# Altium schematic sheet CPU_ETH.SchDoc: Thermostat
size 420 x 297 mm; Author: G.Kasprowicz; CompanyName: WUT ISE; DrawnBy: G.Kasprowicz; Organization: WUT ISE; Address1: PW ISE; Address2: Nowowiejska 15/19 00-665 Warsaw; Address3: gkasprow@gmail.com; DocumentNumber: 2; Revision: 1.0; SheetNumber: 2; SheetTotal: 2; ModifiedBy: -; CheckedDate: -; Title2: CPU v1.0; DivGrp: WUT ISE; Designer: G.Kasprowicz; ModifiedDate: -; ProjectName: Sensor Box
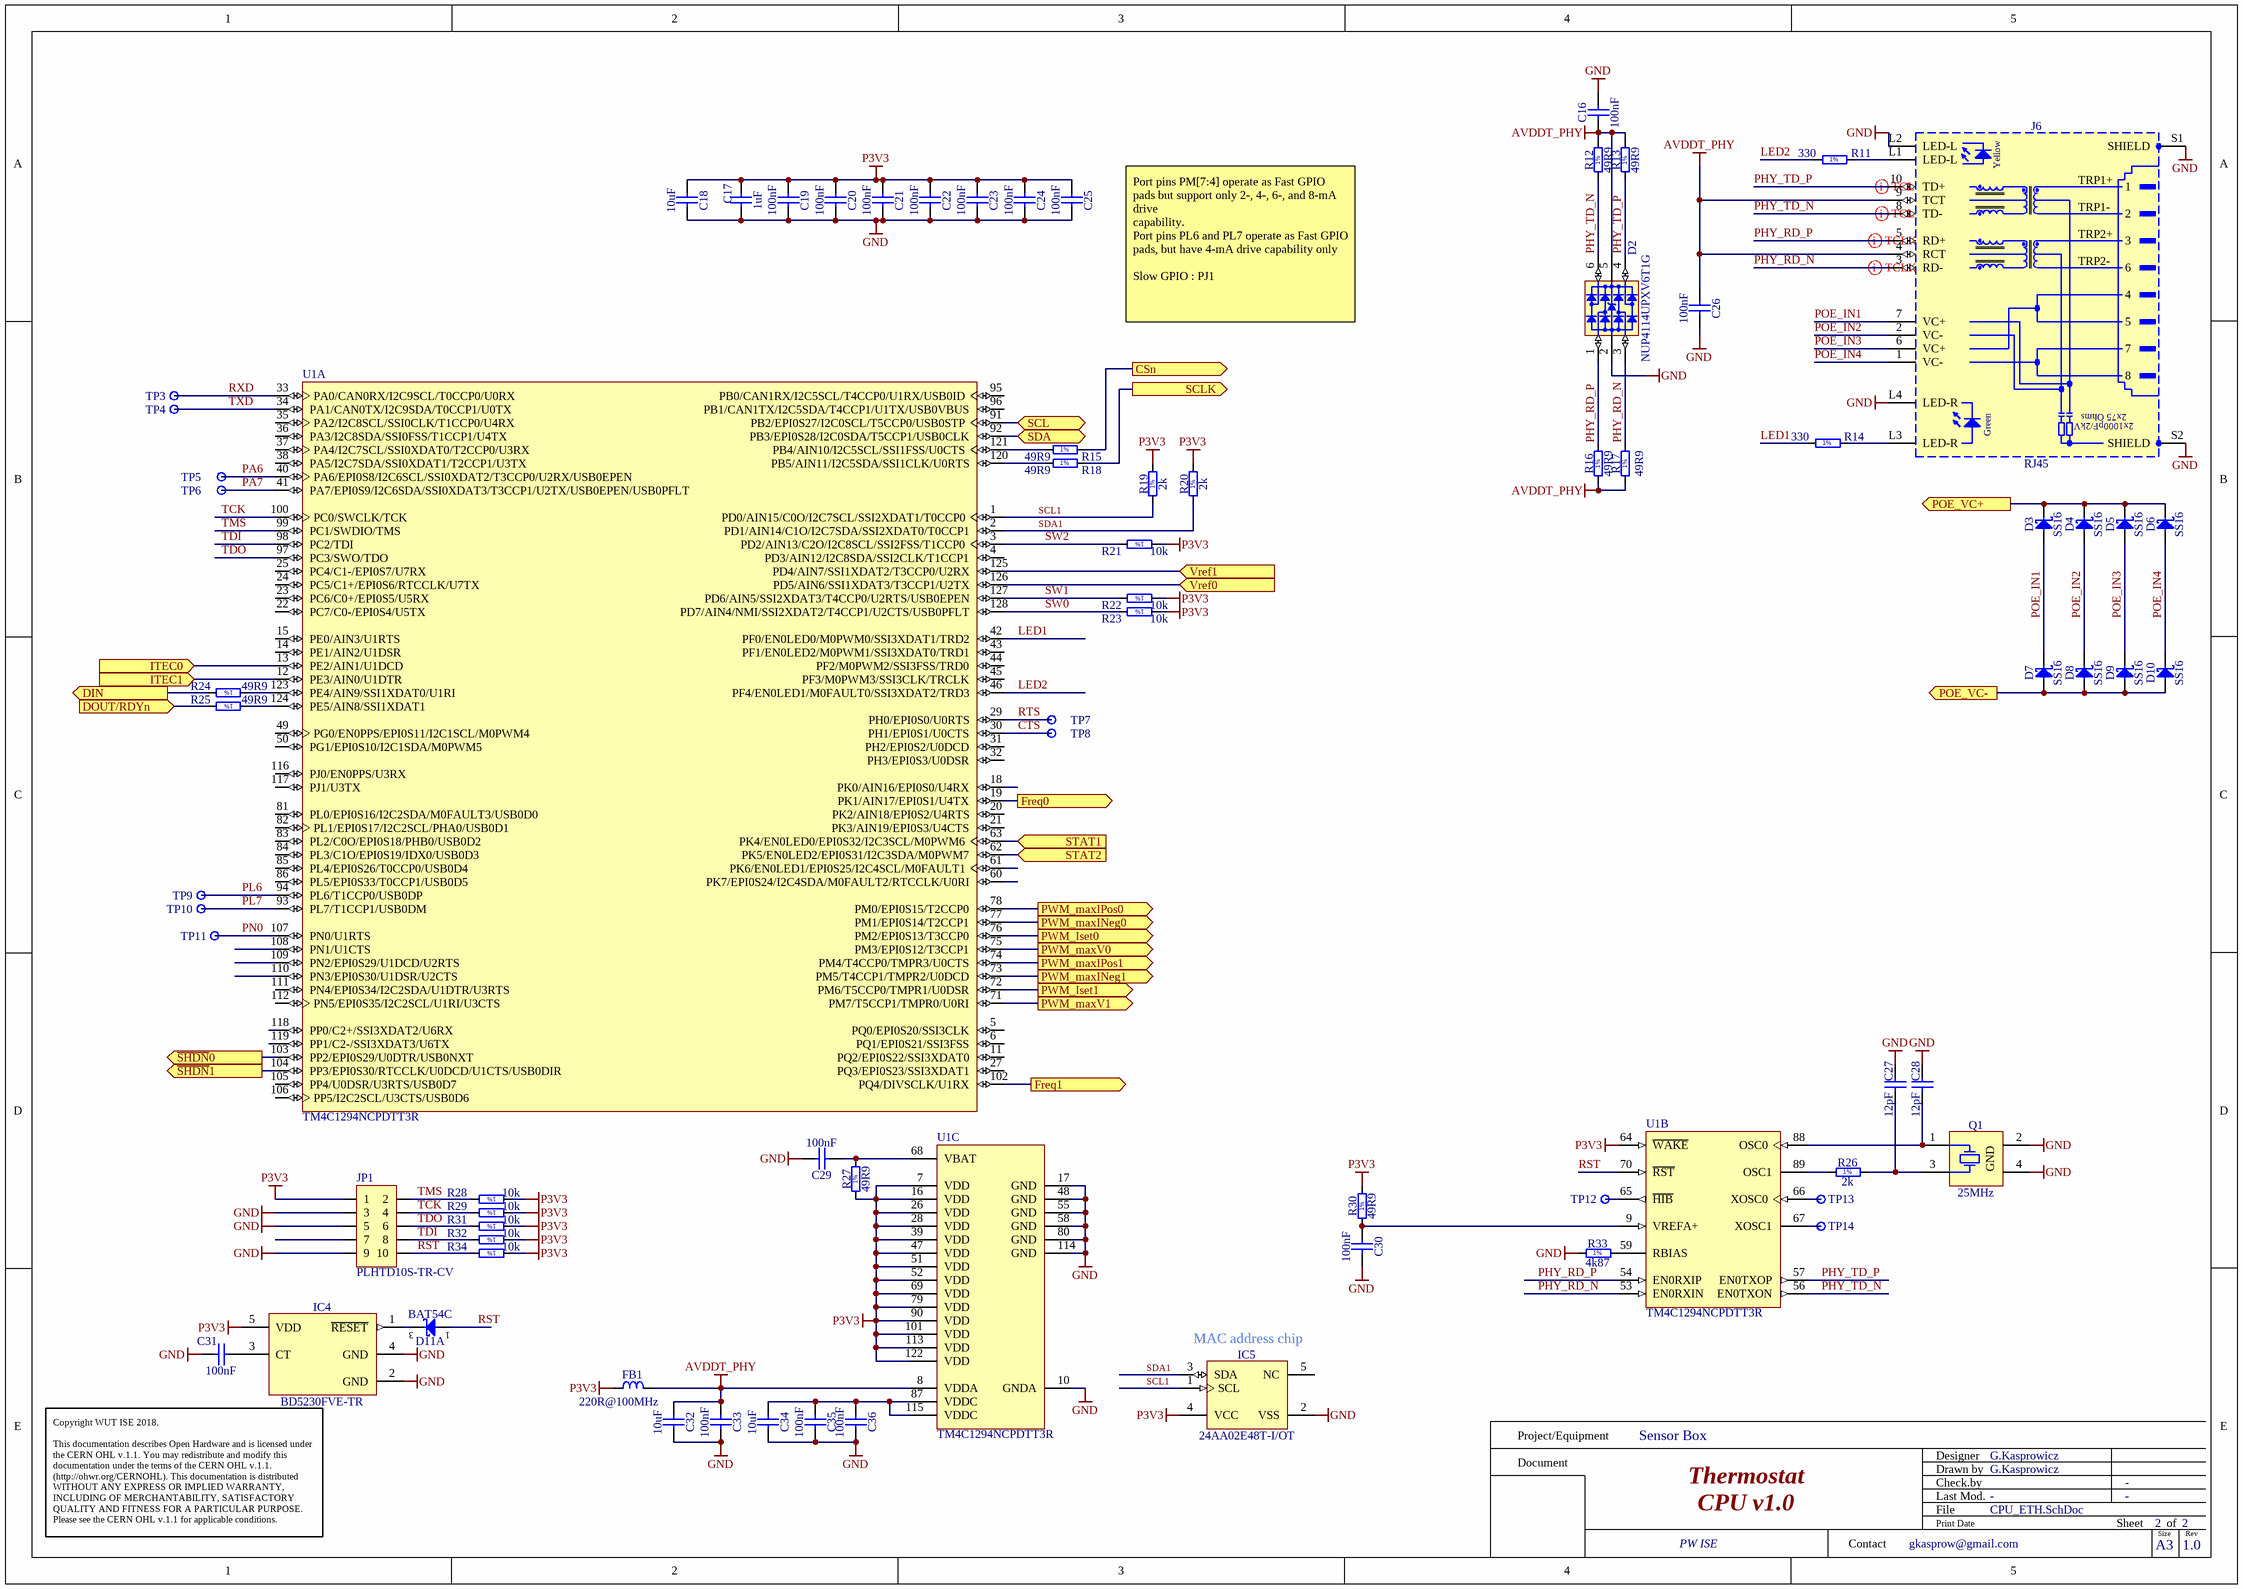
[diagram p0: CPU_ETH.SchDoc]

## Parts
(Parts that share a designator on the sheet are numbered #1, #2 ... from top to bottom, then left to right.)
C16  100nF  [CAPC1005X55N]
C17  1uF  [CAPC1608X87N]
C18  10uF  [CAPC2012X135N]
C19  100nF  [CAPC1005X55N]
C20  100nF  [CAPC1005X55N]
C21  100nF  [CAPC1005X55N]
C22  100nF  [CAPC1005X55N]
C23  100nF  [CAPC1005X55N]
C24  100nF  [CAPC1005X55N]
C25  100nF  [CAPC1005X55N]
C26  100nF  [CAPC1005X55N]
C27  12pF  [CAPC1005X55N]
C28  12pF  [CAPC1005X55N]
C29  100nF  [CAPC1005X55N]
C30  100nF  [CAPC1005X55N]
C31  100nF  [CAPC1005X55N]
C32  10uF  [CAPC2012X135N]
C33  100nF  [CAPC1005X55N]
C34  10uF  [CAPC2012X135N]
C35  100nF  [CAPC1005X55N]
C36  100nF  [CAPC1005X55N]
D2  NUP4114UPXV6T1G  [SOTFL50P160X60-6N]
D3  SS16  [DIOM5127X229N]
D4  SS16  [DIOM5127X229N]
D5  SS16  [DIOM5127X229N]
D6  SS16  [DIOM5127X229N]
D7  SS16  [DIOM5127X229N]
D8  SS16  [DIOM5127X229N]
D9  SS16  [DIOM5127X229N]
D10  SS16  [DIOM5127X229N]
D11  BAT54C  [SOT95P240X130-3N]  (part A of 2)
FB1  220R@100MHz  [INDC2012X105N]
IC4  BD5230FVE-TR  [SOT95P280X145-5N]
IC5  24AA02E48T-I/OT  [SOT95P280X145-5N]
J6  RJ45  [ABRACON_ARJM11C7-114-BA-EW2]
JP1  PLHTD10S-TR-CV  [PLHTD10S-TR-CV]
Q1  25MHz  [XTAL_NDK_NX3225GA]
R11  330  [RESC1005X40N]
R12  49R9  [RESC1005X40N]
R13  49R9  [RESC1005X40N]
R14  330  [RESC1005X40N]
R15  49R9  [RESC1005X40N]
R16  49R9  [RESC1005X40N]
R17  49R9  [RESC1005X40N]
R18  49R9  [RESC1005X40N]
R19  2k  [RESC1005X40N]
R20  2k  [RESC1005X40N]
R21  10k  [RESC1005X40N]
R22  10k  [RESC1005X40N]
R23  10k  [RESC1005X40N]
R24  49R9  [RESC1005X40N]
R25  49R9  [RESC1005X40N]
R26  2k  [RESC1005X40N]
R27  49R9  [RESC1005X40N]
R28  10k  [RESC1005X40N]
R29  10k  [RESC1005X40N]
R30  49R9  [RESC1005X40N]
R31  10k  [RESC1005X40N]
R32  10k  [RESC1005X40N]
R33  4k87  [RESC1005X40N]
R34  10k  [RESC1005X40N]
TP3  Test Point  [TPS127]  (value not drawn)
TP4  Test Point  [TPS127]  (value not drawn)
TP5  Test Point  [TPS127]  (value not drawn)
TP6  Test Point  [TPS127]  (value not drawn)
TP7  Test Point  [TPS127]  (value not drawn)
TP8  Test Point  [TPS127]  (value not drawn)
TP9  Test Point  [TPS127]  (value not drawn)
TP10  Test Point  [TPS127]  (value not drawn)
TP11  Test Point  [TPS127]  (value not drawn)
TP12  Test Point  [TPS127]  (value not drawn)
TP13  Test Point  [TPS127]  (value not drawn)
TP14  Test Point  [TPS127]  (value not drawn)
U1#1  TM4C1294NCPDTT3R  [PDT0128A_N]  (part A of 3)
U1#2  TM4C1294NCPDTT3R  [PDT0128A_N]  (parts B,C of 3)

## Ports
CSn (out), DIN (out), DOUT/RDYn (in), Freq0 (out), Freq1 (out), ITEC0 (in), ITEC1 (in), POE_VC+ (out), POE_VC- (out), PWM_Iset0 (out), PWM_Iset1 (out), PWM_maxINeg0 (out), PWM_maxINeg1 (out), PWM_maxIPos0 (out), PWM_maxIPos1 (out), PWM_maxV0 (out), PWM_maxV1 (out), SCL (bidir), SCLK (out), SDA (bidir), STAT1 (in), STAT2 (in), Vref0 (in), Vref1 (in), ~{SHDN}0 (out), ~{SHDN}1 (out)

## Nets
AVDDT_PHY: C16.1 C26.2 C32.1 C33.2 D2.5(VBUS) FB1.2 J6.4(RCT) J6.9(TCT) R12.2 R13.2 R16.1 R17.1 U1#2.8(VDDA)
GND: C16.2 C17.1 C18.2 C19.1 C20.1 C21.1 C22.1 C23.1 C24.1 C25.1 C26.1 C27.2 C28.2 C29.1 C30.1 C31.2 C32.2 C33.1 C34.2 C35.1 C36.1 D2.2(GND) IC4.2(GND) IC4.4(GND) IC5.2(VSS) J6.L2(LED-L) J6.L4(LED-R) J6.S1(SHIELD) J6.S2(SHIELD) JP1.3 JP1.5 JP1.9 Q1.2(GND) Q1.4(GND) R33.1 U1#2.10(GNDA) U1#2.17(GND) U1#2.48(GND) U1#2.55(GND) U1#2.58(GND) U1#2.80(GND) U1#2.114(GND)
P3V3: C17.2 C18.1 C19.2 C20.2 C21.2 C22.2 C23.2 C24.2 C25.2 FB1.1 IC4.5(VDD) IC5.4(VCC) JP1.1 R19.2 R20.2 R21.1 R22.1 R23.1 R27.1 R28.1 R29.1 R30.2 R31.1 R32.1 R34.1 U1#2.7(VDD) U1#2.16(VDD) U1#2.26(VDD) U1#2.28(VDD) U1#2.39(VDD) U1#2.47(VDD) U1#2.51(VDD) U1#2.52(VDD) U1#2.64(~{WAKE}) U1#2.69(VDD) U1#2.79(VDD) U1#2.90(VDD) U1#2.101(VDD) U1#2.113(VDD) U1#2.122(VDD)
~{SHDN}0: U1#1.103(PP2/EPI0S29/U0DTR/USB0NXT) ; port ~{SHDN}0
~{SHDN}1: U1#1.104(PP3/EPI0S30/RTCCLK/U0DCD/U1CTS/USB0DIR) ; port ~{SHDN}1
CSn: R15.2 ; port CSn
CTS: TP8.1 U1#1.30(PH1/EPI0S1/U0CTS)
DIN: R24.2 ; port DIN
DOUT/RDYn: R25.2 ; port DOUT/RDYn
Freq0: U1#1.19(PK1/AIN17/EPI0S1/U4TX) ; port Freq0
Freq1: U1#1.102(PQ4/DIVSCLK/U1RX) ; port Freq1
ITEC0: U1#1.13(PE2/AIN1/U1DCD) ; port ITEC0
ITEC1: U1#1.12(PE3/AIN0/U1DTR) ; port ITEC1
LED1: R14.1 U1#1.42(PF0/EN0LED0/M0PWM0/SSI3XDAT1/TRD2)
LED2: R11.1 U1#1.46(PF4/EN0LED1/M0FAULT0/SSI3XDAT2/TRD3)
PA6: TP5.1 U1#1.40(PA6/EPI0S8/I2C6SCL/SSI0XDAT2/T3CCP0/U2RX/USB0EPEN)
PA7: TP6.1 U1#1.41(PA7/EPI0S9/I2C6SDA/SSI0XDAT3/T3CCP1/U2TX/USB0EPEN/USB0PFLT)
PHY_RD_N: D2.3(I/O2) J6.3(RD-) R17.2 U1#2.53(EN0RXIN)
PHY_RD_P: D2.1(I/O1) J6.5(RD+) R16.2 U1#2.54(EN0RXIP)
PHY_TD_N: D2.6(I/O4) J6.8(TD-) R12.1 U1#2.56(EN0TXON)
PHY_TD_P: D2.4(I/O3) J6.10(TD+) R13.1 U1#2.57(EN0TXOP)
PL6: TP9.1 U1#1.94(PL6/T1CCP0/USB0DP)
PL7: TP10.1 U1#1.93(PL7/T1CCP1/USB0DM)
PN0: TP11.1 U1#1.107(PN0/U1RTS)
POE_IN1: D3.2(A) D7.1(C) J6.7(VC+)
POE_IN2: D4.2(A) D8.1(C) J6.2(VC-)
POE_IN3: D5.2(A) D9.1(C) J6.6(VC+)
POE_IN4: D6.2(A) D10.1(C) J6.1(VC-)
POE_VC+: D3.1(C) D4.1(C) D5.1(C) D6.1(C) ; port POE_VC+
POE_VC-: D7.2(A) D8.2(A) D9.2(A) D10.2(A) ; port POE_VC-
PWM_Iset0: U1#1.76(PM2/EPI0S13/T3CCP0) ; port PWM_Iset0
PWM_Iset1: U1#1.72(PM6/T5CCP0/TMPR1/U0DSR) ; port PWM_Iset1
PWM_maxINeg0: U1#1.77(PM1/EPI0S14/T2CCP1) ; port PWM_maxINeg0
PWM_maxINeg1: U1#1.73(PM5/T4CCP1/TMPR2/U0DCD) ; port PWM_maxINeg1
PWM_maxIPos0: U1#1.78(PM0/EPI0S15/T2CCP0) ; port PWM_maxIPos0
PWM_maxIPos1: U1#1.74(PM4/T4CCP0/TMPR3/U0CTS) ; port PWM_maxIPos1
PWM_maxV0: U1#1.75(PM3/EPI0S12/T3CCP1) ; port PWM_maxV0
PWM_maxV1: U1#1.71(PM7/T5CCP1/TMPR0/U0RI) ; port PWM_maxV1
RST: D11.1(A) JP1.10 R34.2 U1#2.70(~{RST})
RTS: TP7.1 U1#1.29(PH0/EPI0S0/U0RTS)
RXD: TP3.1 U1#1.33(PA0/CAN0RX/I2C9SCL/T0CCP0/U0RX)
SCL: U1#1.91(PB2/EPI0S27/I2C0SCL/T5CCP0/USB0STP) ; port SCL
SCL1: IC5.1(SCL) R19.1 U1#1.1(PD0/AIN15/C0O/I2C7SCL/SSI2XDAT1/T0CCP0)
SCLK: R18.2 ; port SCLK
SDA: U1#1.92(PB3/EPI0S28/I2C0SDA/T5CCP1/USB0CLK) ; port SDA
SDA1: IC5.3(SDA) R20.1 U1#1.2(PD1/AIN14/C1O/I2C7SDA/SSI2XDAT0/T0CCP1)
STAT1: U1#1.63(PK4/EN0LED0/EPI0S32/I2C3SCL/M0PWM6) ; port STAT1
STAT2: U1#1.62(PK5/EN0LED2/EPI0S31/I2C3SDA/M0PWM7) ; port STAT2
SW0: R23.2 U1#1.128(PD7/AIN4/NMI/SSI2XDAT2/T4CCP1/U2CTS/USB0PFLT)
SW1: R22.2 U1#1.127(PD6/AIN5/SSI2XDAT3/T4CCP0/U2RTS/USB0EPEN)
SW2: R21.2 U1#1.3(PD2/AIN13/C2O/I2C8SCL/SSI2FSS/T1CCP0)
TCK: JP1.4 R29.2 U1#1.100(PC0/SWCLK/TCK)
TDI: JP1.8 R32.2 U1#1.98(PC2/TDI)
TDO: JP1.6 R31.2 U1#1.97(PC3/SWO/TDO)
TMS: JP1.2 R28.2 U1#1.99(PC1/SWDIO/TMS)
TXD: TP4.1 U1#1.34(PA1/CAN0TX/I2C9SDA/T0CCP1/U0TX)
Vref0: U1#1.126(PD5/AIN6/SSI1XDAT3/T3CCP1/U2TX) ; port Vref0
Vref1: U1#1.125(PD4/AIN7/SSI1XDAT2/T3CCP0/U2RX) ; port Vref1
NetC27_1: C27.1 Q1.3(X) R26.2
NetC28_1: C28.1 Q1.1(X) U1#2.88(OSC0)
NetC29_2: C29.2 R27.2 U1#2.68(VBAT)
NetC30_2: C30.2 R30.1 U1#2.9(VREFA+)
NetC31_1: C31.1 IC4.3(CT)
NetC34_1: C34.1 C35.2 C36.2 U1#2.87(VDDC) U1#2.115(VDDC)
NetD11_3: D11.3(COMC) IC4.1(~{RESET})
NetJ6_L1: J6.L1(LED-L) R11.2
NetJ6_L3: J6.L3(LED-R) R14.2
NetR15_1: R15.1 U1#1.121(PB4/AIN10/I2C5SCL/SSI1FSS/U0CTS)
NetR18_1: R18.1 U1#1.120(PB5/AIN11/I2C5SDA/SSI1CLK/U0RTS)
NetR24_1: R24.1 U1#1.123(PE4/AIN9/SSI1XDAT0/U1RI)
NetR25_1: R25.1 U1#1.124(PE5/AIN8/SSI1XDAT1)
NetR26_1: R26.1 U1#2.89(OSC1)
NetR33_2: R33.2 U1#2.59(RBIAS)
NetTP12_1: TP12.1 U1#2.65(~{HIB})
NetTP13_1: TP13.1 U1#2.66(XOSC0)
NetTP14_1: TP14.1 U1#2.67(XOSC1)

Not connected (* = marked no-connect by the designer): IC5 5(NC); JP1 7; U1#1 4(PD3/AIN12/I2C8SDA/SSI2CLK/T1CCP1) 5(PQ0/EPI0S20/SSI3CLK) 6(PQ1/EPI0S21/SSI3FSS) 11(PQ2/EPI0S22/SSI3XDAT0) 14(PE1/AIN2/U1DSR) 15(PE0/AIN3/U1RTS) 18(PK0/AIN16/EPI0S0/U4RX) 20(PK2/AIN18/EPI0S2/U4RTS) 21(PK3/AIN19/EPI0S3/U4CTS) 22(PC7/C0-/EPI0S4/U5TX) 23(PC6/C0+/EPI0S5/U5RX) 24(PC5/C1+/EPI0S6/RTCCLK/U7TX) 25(PC4/C1-/EPI0S7/U7RX) 27(PQ3/EPI0S23/SSI3XDAT1) 31(PH2/EPI0S2/U0DCD) 32(PH3/EPI0S3/U0DSR) 35(PA2/I2C8SCL/SSI0CLK/T1CCP0/U4RX) 36(PA3/I2C8SDA/SSI0FSS/T1CCP1/U4TX) 37(PA4/I2C7SCL/SSI0XDAT0/T2CCP0/U3RX) 38(PA5/I2C7SDA/SSI0XDAT1/T2CCP1/U3TX) 43(PF1/EN0LED2/M0PWM1/SSI3XDAT0/TRD1) 44(PF2/M0PWM2/SSI3FSS/TRD0) 45(PF3/M0PWM3/SSI3CLK/TRCLK) 49(PG0/EN0PPS/EPI0S11/I2C1SCL/M0PWM4) 50(PG1/EPI0S10/I2C1SDA/M0PWM5) 60(PK7/EPI0S24/I2C4SDA/M0FAULT2/RTCCLK/U0RI) 61(PK6/EN0LED1/EPI0S25/I2C4SCL/M0FAULT1) 81(PL0/EPI0S16/I2C2SDA/M0FAULT3/USB0D0) 82(PL1/EPI0S17/I2C2SCL/PHA0/USB0D1) 83(PL2/C0O/EPI0S18/PHB0/USB0D2) 84(PL3/C1O/EPI0S19/IDX0/USB0D3) 85(PL4/EPI0S26/T0CCP0/USB0D4) 86(PL5/EPI0S33/T0CCP1/USB0D5) 95(PB0/CAN1RX/I2C5SCL/T4CCP0/U1RX/USB0ID) 96(PB1/CAN1TX/I2C5SDA/T4CCP1/U1TX/USB0VBUS) 105(PP4/U0DSR/U3RTS/USB0D7) 106(PP5/I2C2SCL/U3CTS/USB0D6) 108(PN1/U1CTS) 109(PN2/EPI0S29/U1DCD/U2RTS) 110(PN3/EPI0S30/U1DSR/U2CTS) 111(PN4/EPI0S34/I2C2SDA/U1DTR/U3RTS) 112(PN5/EPI0S35/I2C2SCL/U1RI/U3CTS) 116(PJ0/EN0PPS/U3RX) 117(PJ1/U3TX) 118(PP0/C2+/SSI3XDAT2/U6RX) 119(PP1/C2-/SSI3XDAT3/U6TX)

## Layout directives
differential pair: PHY_RD_N, PHY_RD_P, PHY_TD_N, PHY_TD_P

## Notes on the sheet
- Port pins PM[7:4] operate as Fast GPIO pads but support only 2-, 4-, 6-, and 8-mA drive
  capability.
  Port pins PL6 and PL7 operate as Fast GPIO pads, but have 4-mA drive capability only
  Slow GPIO : PJ1
- (near IC5) MAC address chip
- Project/Equipment
- Document
- Designer
- Drawn by
- Check.by
- Copyright WUT ISE 2018.
  This documentation describes Open Hardware and is licensed under the CERN OHL v.1.1. You may redistribute and modify this documentation under the terms of the CERN OHL v.1.1. (http://ohwr.org/CERNOHL). This documentation is distributed WITHOUT ANY EXPRESS OR IMPLIED WARRANTY, INCLUDING OF MERCHANTABILITY, SATISFACTORY QUALITY AND FITNESS FOR A PARTICULAR PURPOSE. Please see the CERN OHL v.1.1 for applicable conditions.
- Contact
- File
- Last Mod.
- Print Date
- Sheet
- Size
- A3
- of
- Rev
- (in symbol CON_ETH_POE_ARJM11C7) Yellow; TRP1+; TRP1-; TRP2+; TRP2-; 2x75 Ohms; Green; 2x1000pF/2kV
- (in symbol R0402_2K_1%_0.0625W_100PPM) 1%
- (in symbol R0402_4K87_1%_0.0625W_100PPM) 1%
- (in symbol R0402_10K_1%_0.0625W_100PPM) 1%
- (in symbol R0402_49R9_1%_0.0625W_100PPM) 1%
- (in symbol R0402_330R_1%_0.0625W_100PPM) 1%

## Library data of the parts
C16 C19-C26 C29-C31 C33 C35 C36 = CC0402_100NF_16V_10%_X5R: Non-polarised capacitor; Part Description: SMD Multilayer Chip Ceramic Capacitor; Manufacturer: GENERIC; Manufacturer1 Part Number: GRM155R61C104KA88D; Voltage: 16V; TC: X5R; Tolerance: ±10%; Part Number: CC0402_100NF_16V_10%_X5R; Component Kind: Standard; Component Type: Standard; Pin Count: 2; Value: 100nF; Status: None; Manufacturer Part Number: CC0402_100NF_16V_10%_X5R; Case: 0402; Mounted: Yes; Socket: No; SMD: Yes; Manufacturer1 Example: MURATA; Manufacturer1 ComponentHeight: 0.55mm; HelpURL: \\cern.ch\dfs\Applications\Altium\Datasheets\CC0402_X5R_MURATA_GRM.pdf; Author: CERN DEM JLC; CreateDate: 10.12.2013; LatestRevisionDate: 10.12.2013; Sense: No
C17 = CC0603_1UF_25V_10%_X7R: Non-polarised capacitor; Part Description: SMD Multilayer Chip Ceramic Capacitor; Manufacturer: GENERIC; Manufacturer1 Part Number: GRM188R71E105KA12D; Voltage: 25V; TC: X7R; Tolerance: ±10%; Table: Capacitors SMD; Part Number: CC0603_1UF_25V_10%_X7R; Component Kind: Standard; Component Type: Standard; Pin Count: 2; Value: 1uF; Status: None; Manufacturer Part Number: CC0603_1UF_25V_10%_X7R; Case: 0603; Mounted: Yes; Socket: No; SMD: Yes; Manufacturer1 Example: MURATA; Manufacturer1 ComponentHeight: 0.9mm; HelpURL: \\cern.ch\dfs\Applications\Altium\Datasheets\CC0603_X7R_MURATA.pdf; Author: CERN DEM JLC; CreateDate: 2011-01-18; LatestRevisionDate: 2011-01-18
C18 C32 C34 = CC0805_10UF_16V_10%_X5R: Non-polarised capacitor; Part Description: SMD Multilayer Chip Ceramic Capacitor; Manufacturer: GENERIC; Manufacturer1 Part Number: C0805C106K4PAC; Voltage: 16V; TC: X5R; Tolerance: ±10%; Part Number: CC0805_10UF_16V_10%_X5R; Component Kind: Standard; Component Type: Standard; Pin Count: 2; Value: 10uF; Status: Preferred; Manufacturer Part Number: CC0805_10UF_16V_10%_X5R; Case: 0805; Mounted: Yes; Socket: No; SMD: Yes; Manufacturer1 Example: KEMET; Manufacturer1 ComponentHeight: 1.4mm; HelpURL: \\cern.ch\dfs\Applications\Altium\Datasheets\CC1206_X5R_KEMET.pdf; Author: CERN DEM JLC; CreateDate: 03.12.2007; LatestRevisionDate: 03.12.2007; Sense: No
C27 C28 = CC0402_12PF_50V_5%_C0G: Non-polarised capacitor; Part Description: SMD Multilayer Chip Ceramic Capacitor; Manufacturer: GENERIC; Manufacturer1 Part Number: C0402C120J5GACTU; Voltage: 50V; TC: C0G/NP0; Tolerance: ±5%; Part Number: CC0402_12PF_50V_5%_C0G; Component Kind: Standard; Component Type: Standard; Pin Count: 2; Value: 12pF; Status: Preferred; Manufacturer Part Number: CC0402_12PF_50V_5%_C0G; Case: 0402; Mounted: Yes; Socket: No; SMD: Yes; Sense: No; Manufacturer1 Example: KEMET; Manufacturer1 ComponentHeight: 0.55mm; HelpURL: \\cern.ch\dfs\Applications\Altium\Datasheets\CC0805_C0G_KEMET_(Commercial Grade).pdf; Author: CERN DEM JLC; CreateDate: 04.10.2016; LatestRevisionDate: 04.10.2016
D2 = NUP4114UPXV6T1G: Part Description: ESD Protection Diodes Array (8kV) with Low Clamping Voltage; Manufacturer: ON SEMICONDUCTOR; Voltage: 5.5V; PressFit: No; Bonding: No; Part Number: NUP4114UPXV6T1G; Component Kind: Standard; Component Type: Standard; Device: NUP4114UPXV6T1G; PackageDescription: SOTFL (SOT666, SOT563,), 0.50mm, Pitch; 6 Pin, 1.20mm W X 1.60mm L X 0.60mm H Body, IPC Medium Density; Manufacturer Part Number: NUP4114UPXV6T1G; Pin Count: 8; Mounted: Yes; Socket: No; SMD: Yes; Sense: No; ComponentHeight: 1.75mm; HelpURL: \\cern.ch\dfs\Applications\Altium\Datasheets\NUP4114UPXV6T1G.pdf; Author: CERN DEM JLC; CreateDate: 05.12.2012; LatestRevisionDate: 05.12.2012
D3-D10 = SS16: Schottky Diode; Part Description: Surface Mount Schottky Barrier Rectifier; Manufacturer: VISHAY GENERAL SEMICONDUCTOR; Voltage: 60V; Power: 1A; PressFit: No; Bonding: No; Part Number: SS16; Component Kind: Standard; Component Type: Standard; Device: SS16; PackageDescription: DO-214-AC Molded Diode, Body 5.1x2.7mm, IPC Medium Density; Manufacturer Part Number: SS16; Pin Count: 2; Case: DO-214AC; Mounted: Yes; Socket: No; SMD: Yes; Sense: No; ComponentHeight: 2.29mm; HelpURL: \\cern.ch\dfs\Applications\Altium\Datasheets\SS16.pdf; Author: CERN DEM JLC; CreateDate: 15.07.2008; LatestRevisionDate: 23.08.2010
D11 = BAT54C: Dual Common Cathode Schottky Diodes; Part Description: Dual Common Cathode Small Signal Schottky Diode; Manufacturer: FAIRCHILD SEMICONDUCTOR; Voltage: 30V; Power: 200mA; PressFit: No; Bonding: No; Part Number: BAT54C; Component Kind: Standard; Component Type: Standard; Device: BAT54C; PackageDescription: SOT23 3-Leads, Pitch 0.95mm - Body 1.3x2.9mm, IPC Medium Density; Manufacturer Part Number: BAT54C; Pin Count: 3; Case: SOT23-3; Mounted: Yes; Socket: No; SMD: Yes; ComponentHeight: 1.30mm; HelpURL: \\cern.ch\dfs\Applications\Altium\Datasheets\BAT54C.pdf; Author: CERN DEM JLC; CreateDate: 17.09.2009; LatestRevisionDate: 27.05.2010; Sense: No
FB1 = IND0805_MURATA_BLM21PG221SN1D: Inductor; Part Description: SMD EMIFIL Suppression Chip Ferrite Bead; Manufacturer: MURATA; Power: 2A; Resistance: 0.05R; Tolerance: ±25%; Table: Inductors SMD; Part Number: IND0805_MURATA_BLM21PG221SN1D; Component Kind: Standard; Component Type: Standard; Pin Count: 2; Value: 220R@100MHz; Status: None; Manufacturer Part Number: BLM21PG221SN1D; Case: 0805; Mounted: Yes; Socket: No; SMD: Yes; ComponentHeight: 1.05mm; HelpURL: \\cern.ch\dfs\Applications\Altium\Datasheets\IND0402_MURATA_BLM21P.pdf; Author: CERN DEM JLC; CreateDate: 2010-01-25; LatestRevisionDate: 2010-01-25
IC4 = VMON_BD5230FVE-TR: Free Delay Time Setting  CMOS Voltage Detector; Part Description: 5V, Low Quiescent Current, Programmable-Delay Supervisory Circuit; Manufacturer: Rohm; PressFit: No; Bonding: No; Part Number: BD5230FVE-TR; Component Kind: Standard; Component Type: Standard; Device: BD5230FVE-TR; PackageDescription: SOT23, 5-Leads, Body 1.6x3.0mm, Pitch 0.95mm, IPC Medium Density; Manufacturer Part Number: BD5230FVE-TR; Pin Count: 5; Case: SOT23-5; Mounted: Yes; Socket: No; SMD: Yes; Sense: No; ComponentHeight: 1.45mm; Author: GK; HelpURL: \\cern.ch\dfs\Applications\Altium\Datasheets\TPS3808G50DBVT.pdf; CreateDate: 02.03.2015; LatestRevisionDate: 02.03.2015
IC5 = 24AA02E48T-I/OT: 1.7V-5.5V, 2K I2C Serial EEPROM With EUI-48 Node Identity; Manufacturer: MICROCHIP TECHNOLOGY; PressFit: No; Bonding: No; Part Number: 24AA02E48T-I/OT; Component Kind: Standard; Component Type: Standard; Device: 24AA02E48T-I/OT; PackageDescription: SOT, 0.95mm pitch; 5 pin, 1.60mm W X 2.90mm L X 1.45mm H body, IPC Medium Density; Part Description: 1.7V-5.5V, 2K I2C Serial EEPROM With EUI-48 Node Identity; Manufacturer Part Number: 24AA02E48T-I/OT; Pin Count: 5; Case: SOT23-5; Mounted: Yes; Socket: No; SMD: Yes; Sense: No; ComponentHeight: 1.45mm; HelpURL: \\cern.ch\dfs\Applications\Altium\Datasheets\24AA02E48T-I-OT.pdf; Author: CERN DEM MR; CreateDate: 31.03.2016; LatestRevisionDate: 31.03.2016
J6 = CON_ETH_POE_ARJM11C7: MagJack 10/100BaseT, PoE+, 1X1, OG/Y, -40 to 85*C, Tab Up, RoHS; Part Number: ARJM11C7-114-BA-EW2; Part Description: 1 Port, Orange Green/Yellow LEDs, RJ45 10/100BaseT, PoE, Ethernet MagJack® Connector Module; Manufacturer: Abracon; PressFit: No; Component Kind: Standard; Component Type: Standard; Pin Count: 18; Family: RJ45; Mounted: Yes; Socket: No; SMD: No; Sense: No; Status: None; Manufacturer Part Number: ARJM11C7-114-BA-EW2; ComponentHeight: 13.61mm; HelpURL: \\cern.ch\dfs\Applications\Altium\Datasheets\BELFUSE_0826-1X1T-GJ-F.pdf; Author: GK; CreateDate: 05.11.2012; LatestRevisionDate: 05.11.2012
JP1 = CON_2x5 1.27 SMT Male: 1.27 mm dual row goldpin (Maritex)
Q1 = XTAL_25MHZ_NDK_NX3225GA: Crystal 4 pins 1=XTAL Control 2=GND3=XTAL 4=GND; Part Description: Tolerance: ± 20ppm, Stability: ± 30ppm, -40°C to +85°C, 8pF, 50 Ohms ESR, Automotive Quartz Crystal, NX3225GA Series; Manufacturer: NDK; Manufacturer Part Number: NX3225GA-25.000M-STD-CRG; PressFit: No; Bonding: No; Part Number: XTAL_25MHZ_NDK_NX3225GA; Component Kind: Standard; Component Type: Standard; PackageDescription: 4 Pins, SMD Crystal, Body 2.5x3.2mm, NX3225GA Series; Value: 25MHz; Pin Count: 4; Mounted: Yes; Socket: No; SMD: Yes; Sense: No; ComponentHeight: 0.9mm; HelpURL: \\cern.ch\dfs\Applications\Altium\Datasheets\XTAL_NDK_NX3225GA.pdf; Author: CERN DEM MR; CreateDate: 15.02.2018; LatestRevisionDate: 15.02.2018
R11 R14 = R0402_330R_1%_0.0625W_100PPM: Resistor - 1%; Part Description: General Purpose Thick Film Chip Resistor; Manufacturer: GENERIC; Manufacturer1 Part Number: 232270673301L; TC: ±100ppm/°C; PressFit: No; Part Number: R0402_330R_1%_0.0625W_100PPM; Component Kind: Standard; Component Type: Standard; Pin Count: 2; Value: 330; Status: Not Recommended; Power: 0.0625W; Tolerance: ±1%; Manufacturer Part Number: R0402_330R_1%_0.0625W_100PPM; Case: 0402; Mounted: Yes; Sense: No; Socket: No; SMD: Yes; Manufacturer1 Example: YAGEO PHYCOMP; Manufacturer1 ComponentHeight: 0.4mm; HelpURL: \\cern.ch\dfs\Applications\Altium\Datasheets\R0402_Phycomp_RC0402.pdf; Author: CERN DEM JLC; CreateDate: 03.12.2007; LatestRevisionDate: 17.10.2012
R12 R13 R15-R18 R24 R25 R27 R30 = R0402_49R9_1%_0.0625W_100PPM: Resistor - 1%; Part Description: General Purpose Thick Film Chip Resistor; Manufacturer: GENERIC; Manufacturer1 Part Number: 232270674999L or RC0402FR-0749R9L; TC: ±100ppm/°C; Table: Resistors SMD; Part Number: R0402_49R9_1%_0.0625W_100PPM; Component Kind: Standard; Component Type: Standard; Pin Count: 2; Value: 49R9; Status: Not recommended; Power: 0.0625W; Tolerance: ±1%; Manufacturer Part Number: R0402_49R9_1%_0.0625W_100PPM; Case: 0402; Mounted: Yes; Socket: No; SMD: Yes; Manufacturer1 Example: YAGEO PHYCOMP; Manufacturer1 ComponentHeight: 0.4mm; HelpURL: \\cern.ch\dfs\Applications\Altium\Datasheets\R0402_Phycomp_RC0402.pdf; Author: CERN DEM JLC; CreateDate: 2012-10-24; LatestRevisionDate: 2012-10-24
R19 R20 R26 = R0402_2K_1%_0.0625W_100PPM: Resistor - 1%; Part Description: General Purpose Thick Film Chip Resistor; Manufacturer: GENERIC; Manufacturer1 Part Number: 232270672002L; TC: ±100ppm/°C; PressFit: No; Part Number: R0402_2K_1%_0.0625W_100PPM; Component Kind: Standard; Component Type: Standard; Pin Count: 2; Value: 2k; Status: Not Recommended; Power: 0.0625W; Tolerance: ±1%; Manufacturer Part Number: R0402_2K_1%_0.0625W_100PPM; Case: 0402; Mounted: Yes; Socket: No; SMD: Yes; Manufacturer1 Example: YAGEO PHYCOMP; Manufacturer1 ComponentHeight: 0.4mm; HelpURL: \\cern.ch\dfs\Applications\Altium\Datasheets\R0402_Phycomp_RC0402.pdf; Author: CERN DEM JLC; CreateDate: 03.12.2007; LatestRevisionDate: 17.10.2012; Sense: No
R21-R23 R28 R29 R31 R32 R34 = R0402_10K_1%_0.0625W_100PPM: Resistor - 1%; Part Description: General Purpose Thick Film Chip Resistor; Manufacturer: GENERIC; Manufacturer1 Part Number: 232270671003L; TC: ±100ppm/°C; Table: Resistors SMD; Part Number: R0402_10K_1%_0.0625W_100PPM; Component Kind: Standard; Component Type: Standard; Pin Count: 2; Value: 10k; Status: Not recommended; Power: 0.0625W; Tolerance: ±1%; Manufacturer Part Number: R0402_10K_1%_0.0625W_100PPM; Case: 0402; Mounted: Yes; Socket: No; SMD: Yes; Manufacturer1 Example: YAGEO PHYCOMP; Manufacturer1 ComponentHeight: 0.4mm; HelpURL: \\cern.ch\dfs\Applications\Altium\Datasheets\R0402_Phycomp_RC0402.pdf; Author: CERN DEM JLC; CreateDate: 2007-12-03; LatestRevisionDate: 2012-10-17
R33 = R0402_4K87_1%_0.0625W_100PPM: Resistor - 1%; Part Description: General Purpose Thick Film Chip Resistor; Manufacturer: GENERIC; Manufacturer1 Part Number: CRCW04024K87FKED; TC: ±100ppm/°C; PressFit: No; Part Number: R0402_4K87_1%_0.0625W_100PPM; Component Kind: Standard; Component Type: Standard; Pin Count: 2; Value: 4k87; Status: None; Power: 0.0625W; Tolerance: ±1%; Manufacturer Part Number: R0402_4K87_1%_0.0625W_100PPM; Case: 0402; Mounted: Yes; Sense: No; Socket: No; SMD: Yes; Manufacturer1 Example: VISHAY; Manufacturer1 ComponentHeight: 0.4mm; HelpURL: \\cern.ch\dfs\Applications\Altium\Datasheets\R0402_VISHAY_CRCW e3.pdf; Author: CERN DEM JLC; CreateDate: 04.11.2014; LatestRevisionDate: 04.11.2014
TP3-TP14 = SMD_PAD_1.27X1.27MM: Part Description: 1.27mm x 1.27mm PCB Copper Area (SMD Test Point); Mounted: No; Part Number: SMD_PAD_1.27X1.27MM; Component Kind: Standard (No BOM); Component Type: Standard (No BOM); Pin Count: 1; Family: Test Point; Socket: No; SMD: Yes; Sense: No; Status: None; ComponentHeight: 0mm; HelpURL: Undefined; Author: CERN DEM JLC; CreateDate: 12.01.2008; LatestRevisionDate: 12.01.2008; PackageDescription: 1.27mm x 1.27mm PCB Copper Area (SMD Test Point)
U1#1 U1#2 = CMP-0945-00009-2: Tiva C Series Microcontroller, 1024 KB Flash, 256 KB SRAM, 12 Bit, 20 Channels, -40 to 105 degC, 128-Pin TQFP (PDT), Green (RoHS & no Sb/Br), Tape and Reel; Manufacturer: Texas Instruments; ADC Resolution: 12 Bits; Max Speed: 120 MHz; ADC Channels: 20; CPU: ARM Cortex-M4; Flash: 1024 KB; SRAM: 256 KB; ComponentLink3URL: http://www.ti.com/lit/ml/mpqf013/mpqf013.pdf; ComponentLink3Description: Package Specification; ComponentLink2URL: http://www.ti.com/lit/ds/symlink/tm4c1294ncpdt.pdf; Packing: Tape and Reel; ComponentLink1URL: http://www.ti.com/; Temperature Range: -40 to 105 degC; PackageReference: PDT0128A; PackageVersion: 4087726/A; ComponentLink2Description: Datasheet; PartNumber: TM4C1294NCPDTT3R; ComponentLink1Description: Manufacturer URL; PackageDescription: 128-Pin Thin Quad Flat Package, Body 14 x 14 mm, Pitch 0.4 mm; DatasheetVersion: 15863.2743; Eco-Plan: Green (RoHS & no Sb/Br); Mounting Technology: Surface Mount